# EasyEDA Pro project RadioFox1.eprj, schematic Radio Card
Create Date: 2024-01-10; Page Name: SA818S Card; Project Name: RadioFox; Schematic Name: Schematic2; Update Date: 2024-01-09; Company: EasyEDA.com; Drawed: EasyEDA Pro; Page Size: A4; Part Number: JLCPCB-002; Reviewed: EasyEDA Pro; Version: V0.1
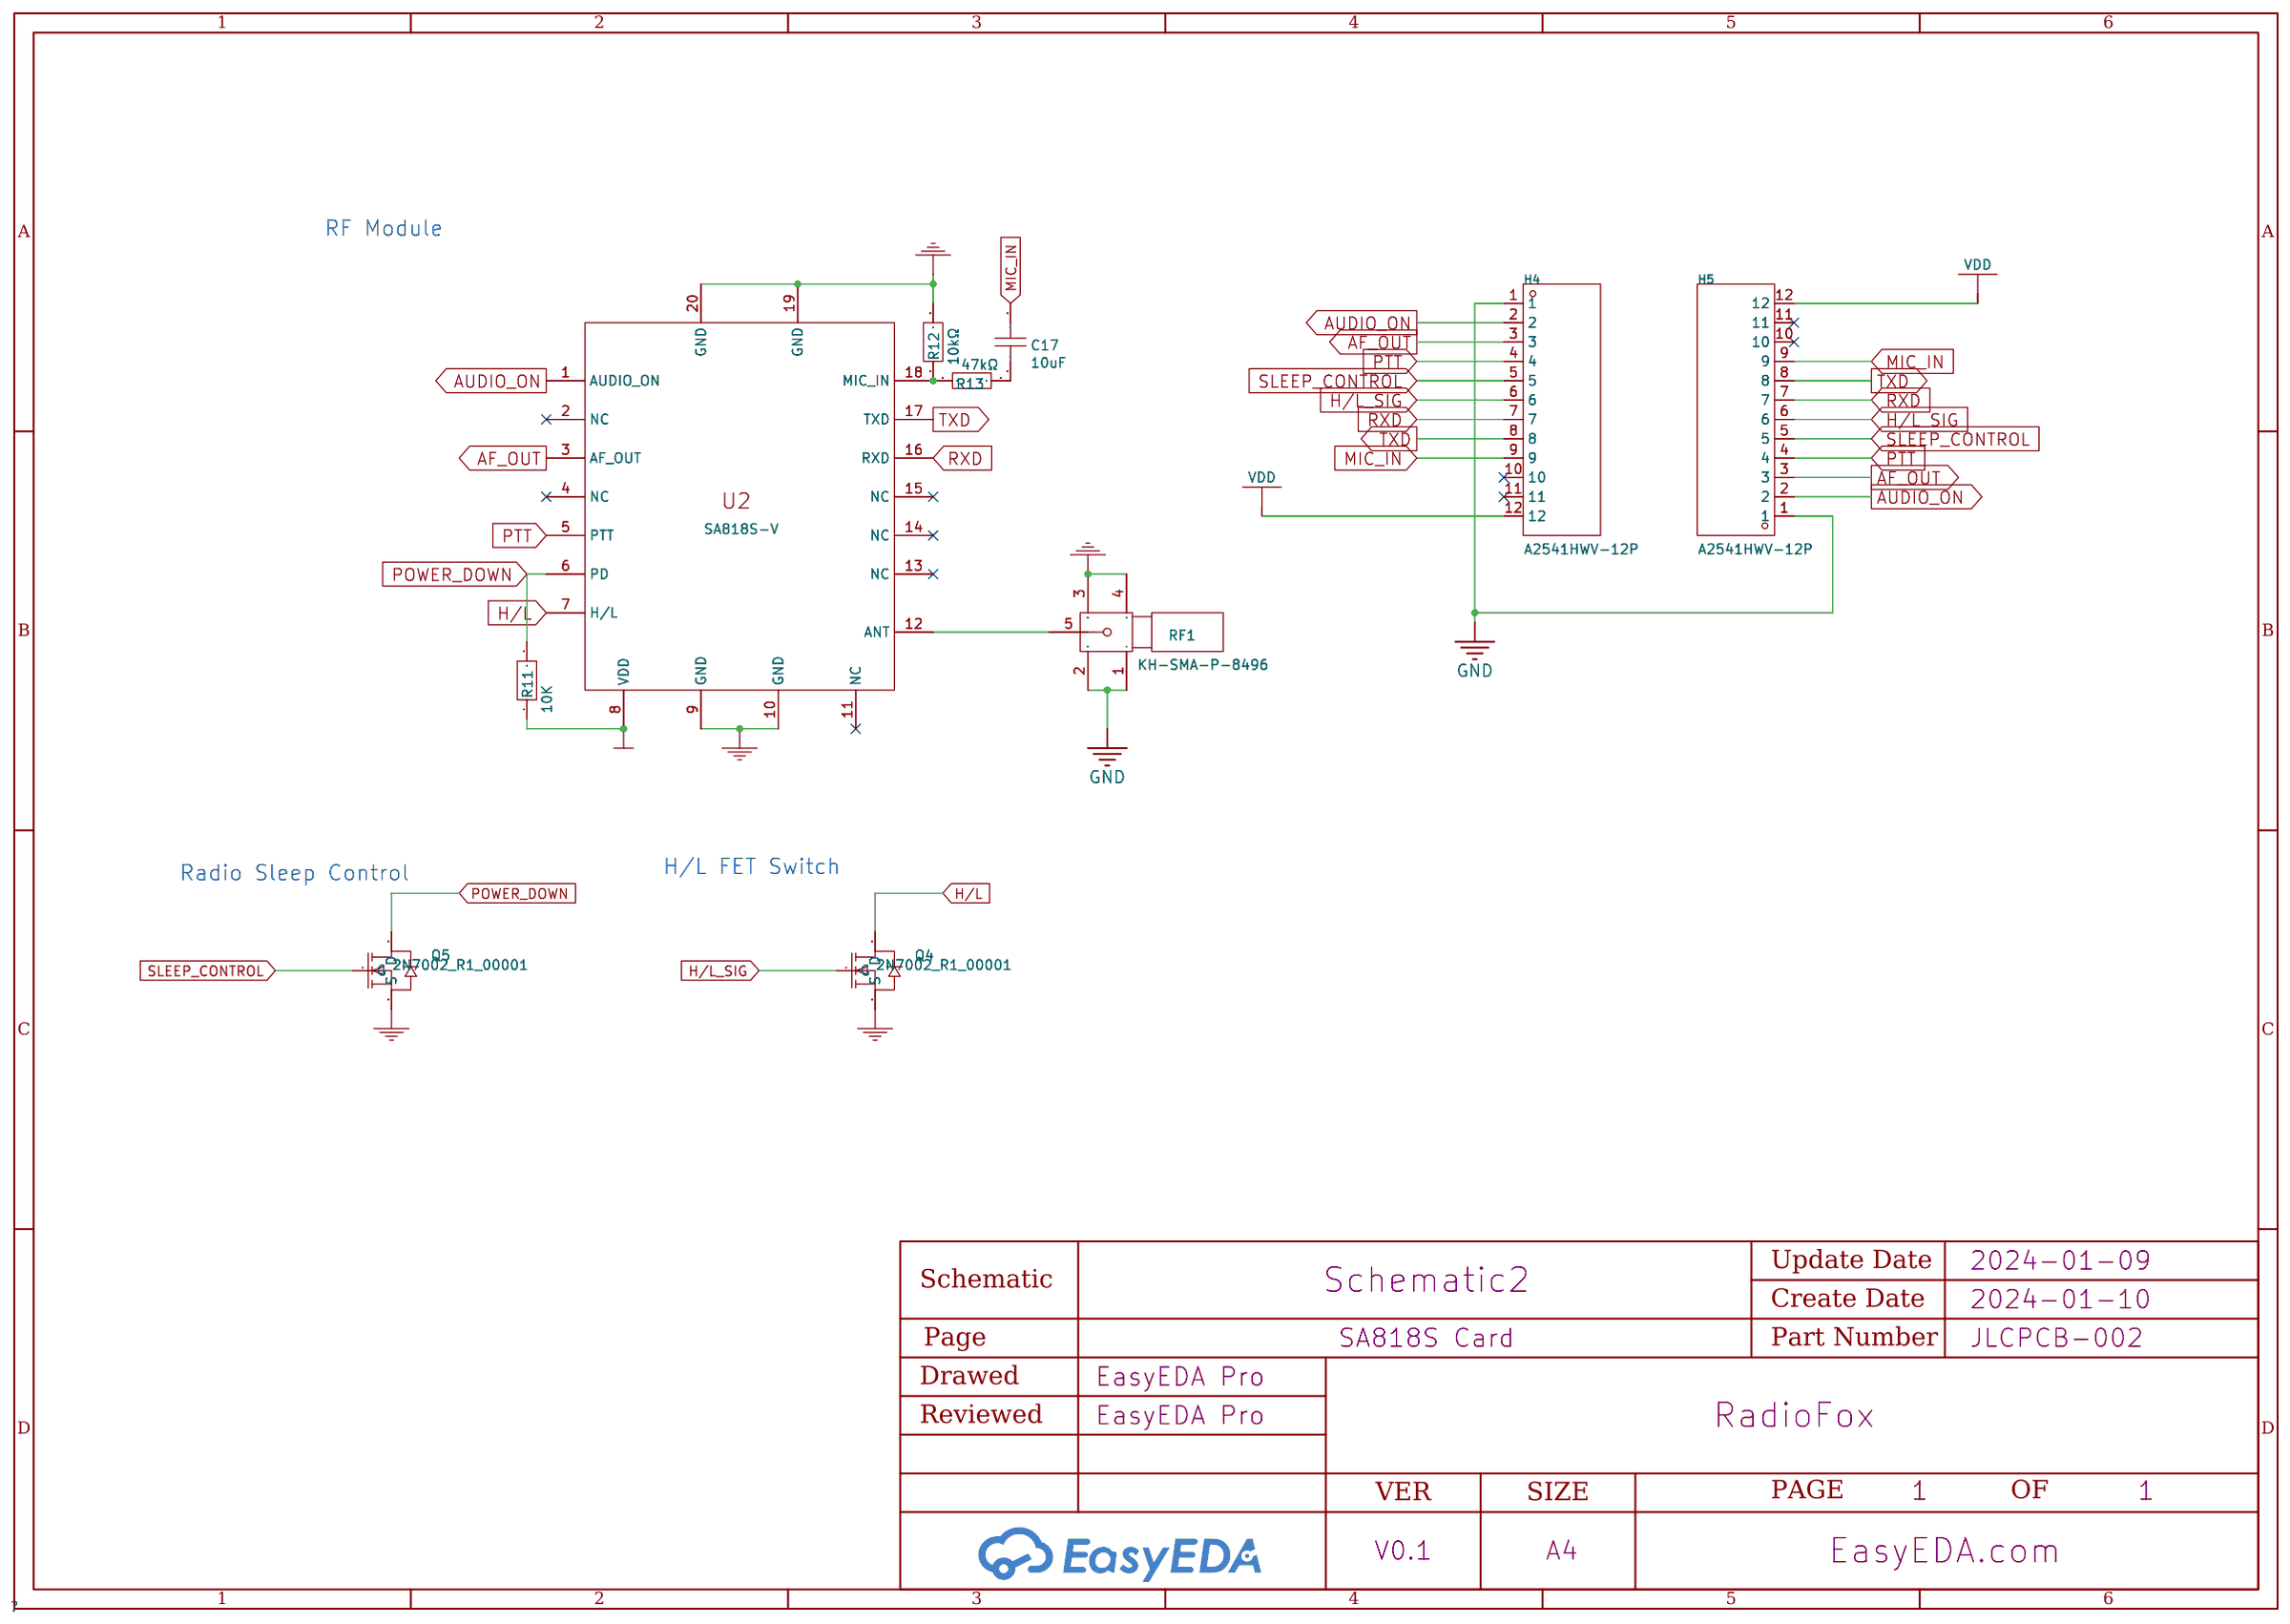
[diagram p0: schematic sheet]

## Parts
C17  10uF  [C1206]
H4  A2541HWV-12P  [HDR-TH_12P-P2.54-V-F]  (no BOM)
H5  A2541HWV-12P  [HDR-TH_12P-P2.54-V-F]  (no BOM)
Q4  2N7002_R1_00001  [SOT-23-3_L2.9-W1.3-P1.90-LS2.4-BR]
Q5  2N7002_R1_00001  [SOT-23-3_L2.9-W1.3-P1.90-LS2.4-BR]
R11  10K  [R0402]
R12  10kΩ  [R0402]
R13  47kΩ  [R0402]
RF1  KH-SMA-P-8496  [SMA-TH_KH-SMA-P-8496]
U2  SA818S-V  [WIRELM-SMD_G-NICERF_SA818S-X]

## Library data of the parts
C17 = 1206F106Z160CT: Capacitance: Tolerance:-20%~+80% Tolerance:-20%~+80% Voltage Rated: Temperature Coefficient:; LCSC Part Name: 10uF -20%~+80% 16V; Supplier Part: C396769; Manufacturer: Walsin(华新科); Supplier Footprint: 1206; JLCPCB Part Class: Extended Part; Datasheet: https://atta.szlcsc.com/upload/public/pdf/source/20191217/C469650_84AD5C6F618CF4AC0C6D987F2E8FE6F8.pdf; Supplier: LCSC; Tolerance: -20%~+80%
H4 H5 = A2541HWV-12P_C225509: Holes Structure:1x12P Pitch:2.54mm Number of Holes:12P Mounting Type:Straight Number of Rows:Plugin Row Spacing:- Insulation Height:- Contact Material:Brass Contact Plating:Gold; LCSC Part Name: 间距:2.54mm 1x12P 直插 镀金; Supplier Part: C225509; Manufacturer: CJT(长江连接器); Supplier Footprint: 插件,P=2.54mm; JLCPCB Part Class: Extended Part; Datasheet: https://atta.szlcsc.com/upload/public/pdf/source/20180724/C239359_48B1BC0CA1B4E4396A63955AAFD15564.pdf; Supplier: LCSC; Holes Structure: 1x12P; Pitch: 2.54mm; Number of Holes: 12P; Mounting Type: Straight; Number of Rows: Plugin; Contact Material: Brass; Contact Plating: Gold
Q4 Q5 = 2N7002_R1_00001: LCSC Part Name: 2N7002_R1 编带; Supplier Part: C282260; Manufacturer: PANJIT(强茂); Supplier Footprint: SOT-23; JLCPCB Part Class: Extended Part; Datasheet: https://atta.szlcsc.com/upload/public/pdf/source/20190315/C282260_ECC46E71D49323CDB96884DBCEBD7C5B.pdf; Supplier: LCSC
R11 = Res_0402: Supplier Footprint: 0402; Supplier: LCSC; Supplier Part: C465721; Manufacturer: Viking(光颉); Manufacturer Part: AR03BTCX1002A; JLCPCB Part Class: Extended Part
R12 = RC0402FR-0710KL: Type:Thick Film Resistors Resistance: Tolerance:±1% Tolerance:±1% Power(Watts): Temperature Coefficient:±100ppm/℃ Temperature Coefficient:±100ppm/℃ Overload Voltage (Max): Operating Temperature Range:-55℃~+155℃ Operating Temperature Range:-55℃~+155℃; LCSC Part Name: 10kΩ ±1% 62.5mW; Supplier Part: C60490; Manufacturer: YAGEO(国巨); Supplier Footprint: 0402; JLCPCB Part Class: Extended Part; Datasheet: https://atta.szlcsc.com/upload/public/pdf/source/20170606/1496716515432.pdf; Supplier: LCSC; Type: Thick Film Resistors; Tolerance: ±1%; Temperature Coefficient: ±100ppm/℃; Operating Temperature Range: -55℃~+155℃; Resistance: 10K
R13 = RC0402FR-0747KL: Type:Thick Film Resistors Resistance: Tolerance:±1% Tolerance:±1% Power(Watts): Temperature Coefficient:±100ppm/℃ Temperature Coefficient:±100ppm/℃ Overload Voltage (Max): Operating Temperature Range:-55℃~+155℃ Operating Temperature Range:-55℃~+155℃; LCSC Part Name: 厚膜电阻 47kΩ ±1% 62.5mW; Supplier Part: C93943; Manufacturer: YAGEO(国巨); Supplier Footprint: 0402; JLCPCB Part Class: Extended Part; Datasheet: https://atta.szlcsc.com/upload/public/pdf/source/20180821/C275644_0D56F95EFF785E7D9A1FEF436B37DA78.pdf; Supplier: LCSC; Type: Thick Film Resistors; Tolerance: ±1%; Temperature Coefficient: ±100ppm/℃; Operating Temperature Range: -55℃~+155℃; Resistance: 47K
RF1 = KH-SMA-P-8496: Connector Type:板端 Interface Type:内孔 Frequency-Max:- Interface Diameter:5.25mm RF Series:SMA Number of Ports:1 Impedance:- Style:弯头 Interface Length/Height:11mm Operating Temperature Range:- Operating Temperature Range:-; LCSC Part Name: SMA 内孔 弯头 镀金外螺内孔,11牙(三件套); Supplier Part: C910123; Manufacturer: kinghelm(金航标); Supplier Footprint: 插件; JLCPCB Part Class: Extended Part; Datasheet: https://atta.szlcsc.com/upload/public/pdf/source/20210317/C910123_D9C544C7B464C90B55B8BB4FC6044180.pdf; Supplier: LCSC; Connector Type: 板端; Interface Type: 内孔; Interface Diameter: 5.25mm; RF Series: SMA; Number of Ports: 1; Style: 弯头; Interface Length/Height: 11mm
U2 = SA818S-U: LCSC Part Name: 对讲机模块; Manufacturer: G-NiceRF(思为无线); Supplier Footprint: SMD,19x35.6mm; JLCPCB Part Class: Extended Part; Datasheet: https://atta.szlcsc.com/upload/public/pdf/source/20220425/87B569942CB193BEE2E666898149E81A.pdf; Supplier: NiceRF.com

## Nets
5V: R11.1 U2.8(VDD)
GND: H4.1 H5.1 Q4.2(S) Q5.2(S) R12.2 RF1.1 RF1.2 RF1.3 RF1.4 U2.9(GND) U2.10(GND) U2.19(GND) U2.20(GND)
VDD: H4.12 H5.12
AF_OUT: H4.3 H5.3 U2.3(AF_OUT)
AUDIO_ON: H4.2 H5.2 U2.1(AUDIO_ON)
H/L: Q4.3(D) U2.7(H/L)
H/L_SIG: H4.6 H5.6 Q4.1(G)
MIC_IN: C17.1 H4.9 H5.9
POWER_DOWN: Q5.3(D) R11.2 U2.6(PD)
PTT: H4.4 H5.4 U2.5(PTT)
RXD: H4.7 H5.7 U2.16(RXD)
SLEEP_CONTROL: H4.5 H5.5 Q5.1(G)
TXD: H4.8 H5.8 U2.17(TXD)
$1N846: R12.1 R13.1 U2.18(MIC_IN)
$1N847: C17.2 R13.2
$1N852: RF1.5 U2.12(ANT)

Not connected (* = marked no-connect by the designer): H4 10* 11*; H5 10* 11*; U2 2(NC)* 4(NC)* 11(NC)* 13(NC)* 14(NC)* 15(NC)*

## Notes on the sheet
- RF Module
- Radio Sleep Control
- H/L FET Switch
